# EAGLE design DIY_OpenEVSE_PLUS_v2w (EAGLE 7.1.0)
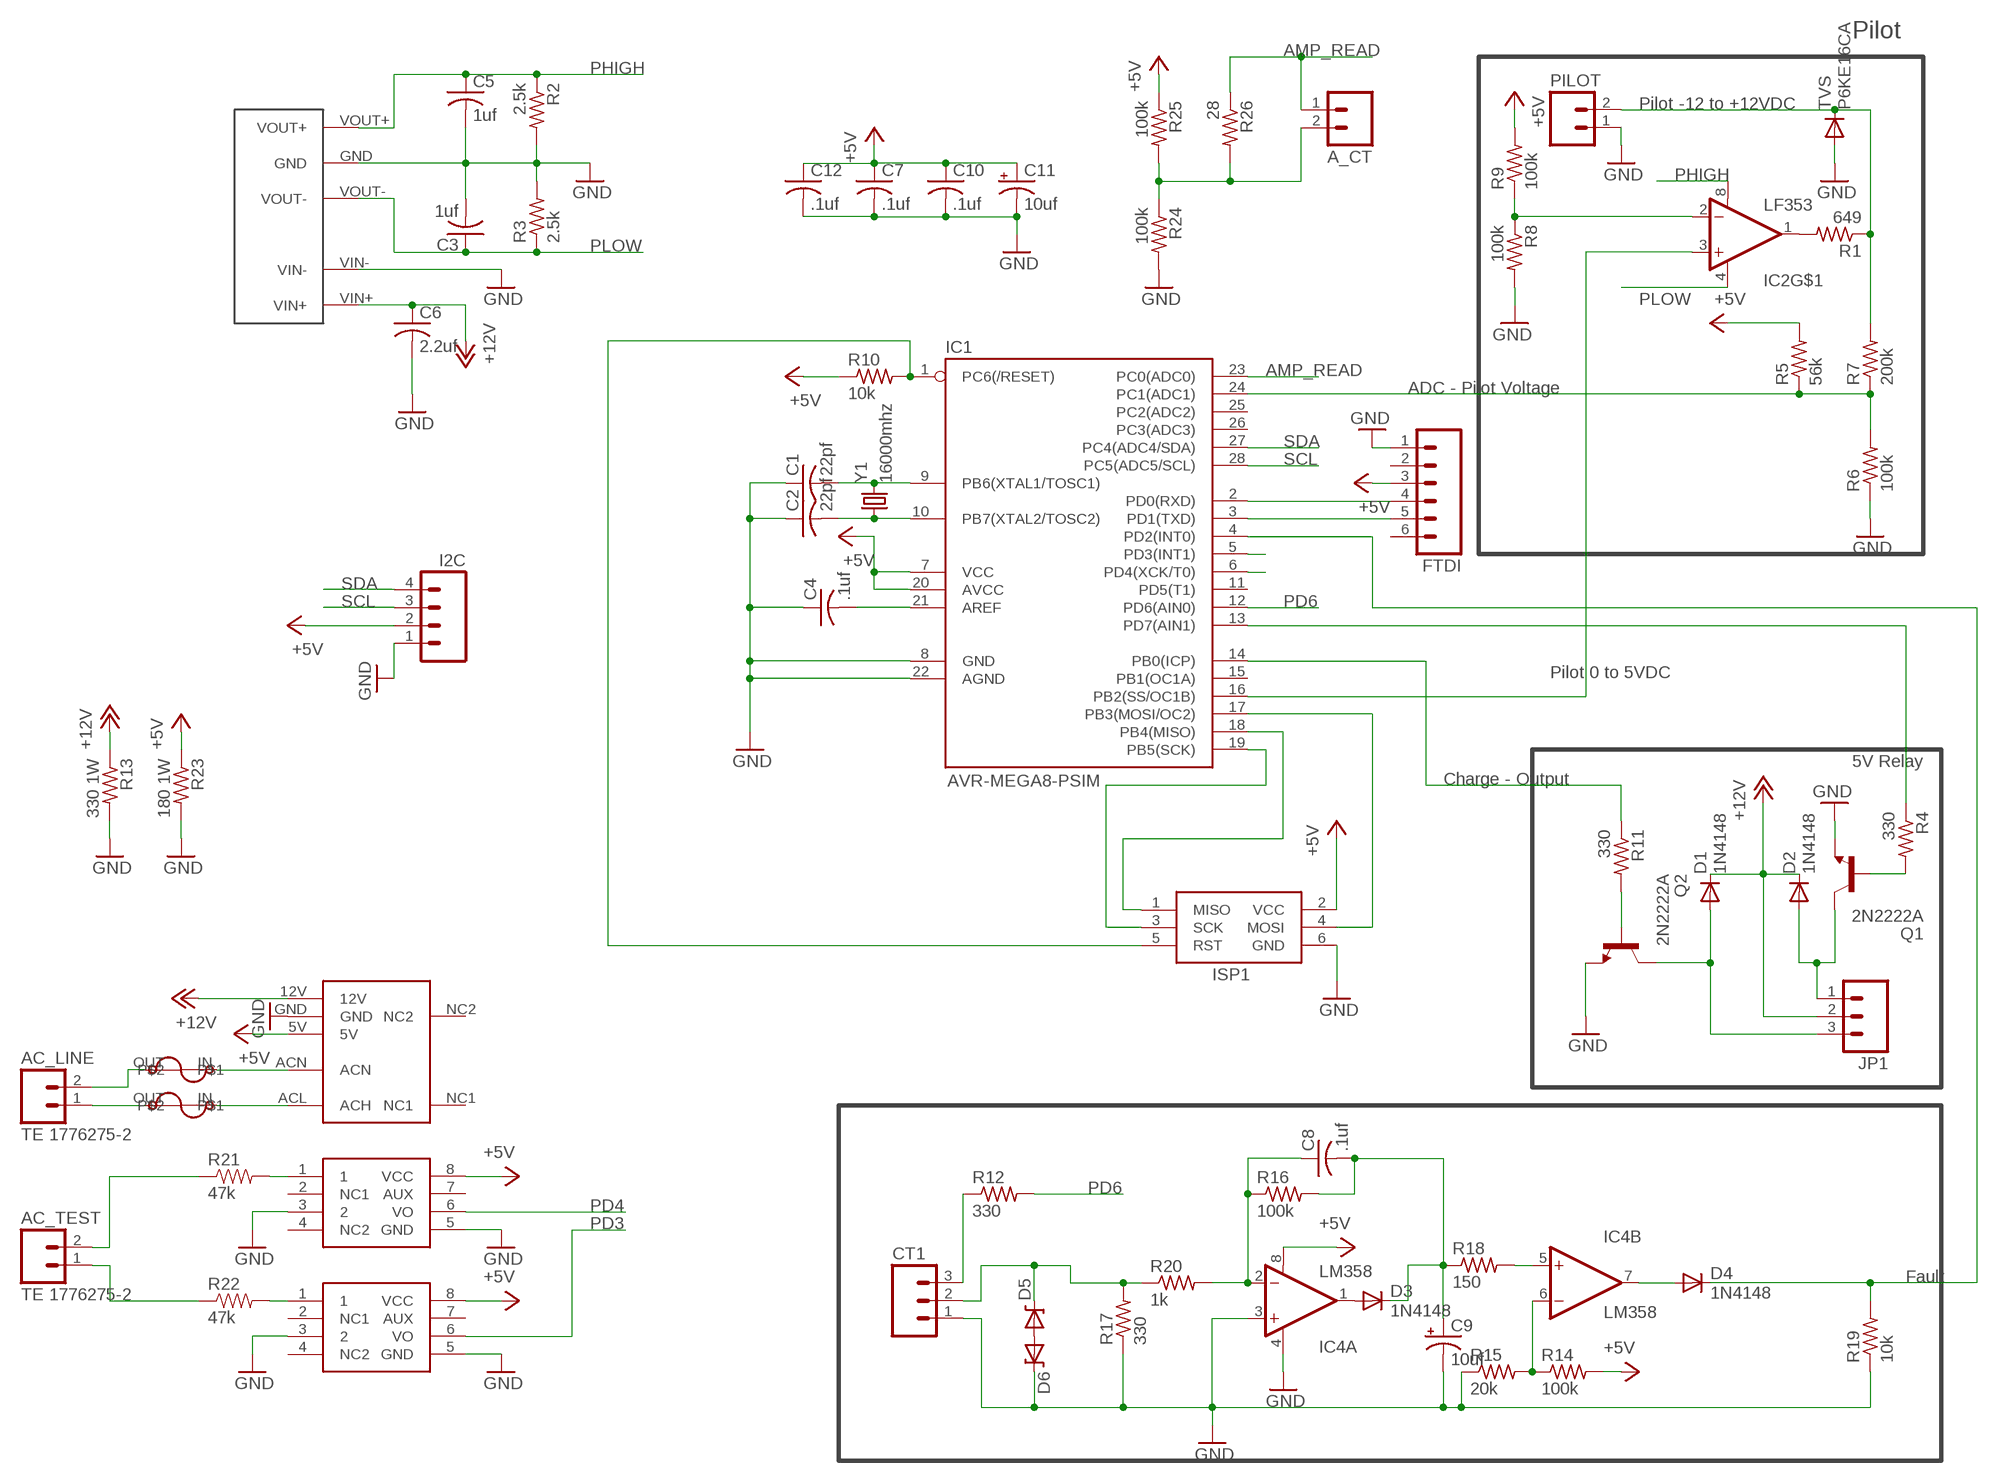
[diagram p0: schematic, sheet 1]

## Parts
A_CT  M02PTH  [1X02]
AC_LINE  TE 1776275-2  M023.5MM_LOCK  [SCREWTERMINAL-3.5MM-2_LOCK]
AC_TEST  TE 1776275-2  M023.5MM_LOCK  [SCREWTERMINAL-3.5MM-2_LOCK]
C1  22pf  C-US025-024X044  [C025-024X044]
C2  22pf  C-US025-024X044  [C025-024X044]
C3  1uf  C-US025-024X044  [C025-024X044]
C4  .1uf  C-US025-024X044  [C025-024X044]
C5  1uf  C-US025-024X044  [C025-024X044]
C6  2.2uf  C-US025-024X044  [C025-024X044]
C7  .1uf  C-US025-024X044  [C025-024X044]
C8  .1uf  C-US025-024X044  [C025-024X044]
C9  10uf  CAP_POLPTH2  [CPOL-RADIAL-10UF-25V]
C10  .1uf  C-US025-024X044  [C025-024X044]
C11  10uf  CAP_POLPTH2  [CPOL-RADIAL-10UF-25V]
C12  .1uf  C-US025-024X044  [C025-024X044]
CT1  M03LOCK  [1X03_LOCK]
D1  1N4148  DIODE1N4148  [DIODE-1N4148]
D2  1N4148  DIODE1N4148  [DIODE-1N4148]
D3  1N4148  DIODE1N4148  [DIODE-1N4148]
D4  1N4148  DIODE1N4148  [DIODE-1N4148]
D5  DIODE-ZENERPTH  [DIODE-ZENER]
D6  DIODE-ZENERPTH  [DIODE-ZENER]
DCDC  D107E  DCDC_SIP  [DCDC_SIP]
FTDI  M06LOCK  [1X06_LOCK]
I2C  M04LOCK  [1X04_LOCK]
IC1  AVR-MEGA8-PSIM  [DIL28-3-SIMON]
IC2  LF353  LM358  [DIP08]
IC3  MID400  [DIP08]
IC4  LM358  OPAMP-DUALDIP  [DIP08]
IC5  MID400  [DIP08]
ISP1  AVRISP-6  [AVRISP]
JP1  M03SCREW_LOCK  [SCREWTERMINAL-3.5MM-3_LOCK.007S]
PILOT  M025MM  [SCREWTERMINAL-5MM-2]
Q1  2N2222A  [TO18]
Q2  2N2222A  [TO18]
R1  649  R-US_0309/V  [0309V]
R2  2.5k  R-US_0309/V  [0309V]
R3  2.5k  R-US_0309/V  [0309V]
R4  330  R-US_0309/V  [0309V]
R5  56k  R-US_0309/V  [0309V]
R6  100k  R-US_0309/V  [0309V]
R7  200k  R-US_0309/V  [0309V]
R8  100k  R-US_0309/V  [0309V]
R9  100k  R-US_0309/V  [0309V]
R10  10k  R-US_0309/V  [0309V]
R11  330  R-US_0309/V  [0309V]
R12  330  R-US_0309/V  [0309V]
R13  330 1W  R-US_0309/V  [0309V]
R14  100k  R-US_0309/V  [0309V]
R15  20k  R-US_0309/V  [0309V]
R16  100k  R-US_0309/V  [0309V]
R17  330  R-US_0309/V  [0309V]
R18  150  R-US_0309/V  [0309V]
R19  10k  R-US_0309/V  [0309V]
R20  1k  R-US_0309/V  [0309V]
R21  47k  RESISTORPTH-1/4W  [AXIAL-0.4]
R22  47k  RESISTORPTH-1/4W  [AXIAL-0.4]
R23  180 1W  R-US_0309/V  [0309V]
R24  100k  R-US_0309/V  [0309V]
R25  100k  R-US_0309/V  [0309V]
R26  28  R-US_0309/V  [0309V]
TVS  P6KE16CA  DIODEPTH  [DIODE-1N4001]
U$3  BEL1AFUSE  [BELFUSE1A]
U$4  MPM-04E-1205  [MPM-04E-1205]
U$5  BEL1AFUSE  [BELFUSE1A]
Y1  16000mhz  CRYSTALHC49UV  [HC49U-V]

## Nets
+5V: C7.1 C10.1 C11.1(+) C12.1 FTDI.3 I2C.2 IC1.7(VCC) IC1.20(AVCC) IC3.8(VCC) IC4.8(A:V+) IC5.8(VCC) ISP1.2(VCC) R5.2 R9.2 R10.1 R14.2 R23.1 R25.1 U$4.5V
+12V: C6.1 D1.C D2.C DCDC.VIN+ JP1.2 R13.1 U$4.12V
AMP_READ: A_CT.1 IC1.23(PC0(ADC0)) R26.1
GND: C1.1 C2.1 C3.2 C4.1 C5.2 C6.2 C7.2 C9.2(-) C10.2 C11.2(-) C12.2 CT1.1 D6.P$1(C) DCDC.GND DCDC.VIN- FTDI.1 I2C.1 IC1.8(GND) IC1.22(AGND) IC3.3 IC3.5(GND) IC4.3(A:+IN) IC4.4(A:V-) IC5.3 IC5.5(GND) ISP1.6(GND) PILOT.1 Q1.1(E) Q2.1(E) R2.2 R3.2 R6.1 R8.2 R13.2 R15.1 R17.1 R19.1 R23.2 R24.2 TVS.A U$4.GND
N$1: AC_LINE.1 U$3.OUT
N$2: Q2.2(B) R11.2
N$3: PILOT.2 R1.1 R7.2 TVS.C
N$4: C1.2 IC1.9(PB6(XTAL1/TOSC1)) Y1.2
N$5: C2.2 IC1.10(PB7(XTAL2/TOSC2)) Y1.1
N$6: AC_LINE.2 U$5.OUT
N$7: C4.2 IC1.21(AREF)
N$8: FTDI.5 IC1.3(PD1(TXD))
N$9: IC3.1 R21.P$2
N$10: IC2.2(-IN) R8.1 R9.1
N$11: IC2.1(OUT) R1.2
N$12: FTDI.4 IC1.2(PD0(RXD))
N$13: D1.A JP1.3 Q2.3(C)
N$14: IC1.17(PB3(MOSI/OC2)) ISP1.4(MOSI)
N$15: IC1.19(PB5(SCK)) ISP1.3(SCK)
N$16: IC1.18(PB4(MISO)) ISP1.1(MISO)
N$17: IC5.1 R22.P$2
N$18: C8.1 IC4.2(A:-IN) R16.1 R20.2
N$19: IC4.5(B:+IN) R18.2
N$20: CT1.2 D5.P$1(C) R17.2 R20.1
N$21: D3.A IC4.1(A:OUT)
N$22: D5.P$2(A) D6.P$2(A)
N$23: C8.2 C9.1(+) D3.C R16.2 R18.1
N$24: IC4.6(B:-IN) R14.1 R15.2
N$25: D4.A IC4.7(B:OUT)
N$26: AC_TEST.2 R21.P$1
N$27: U$3.IN U$4.ACL(ACH)
N$28: D4.C IC1.4(PD2(INT0)) R19.2
N$29: AC_TEST.1 R22.P$1
N$30: U$4.ACN U$5.IN
N$31: Q1.2(B) R4.2
N$32: D2.A JP1.1 Q1.3(C)
N$33: IC1.13(PD7(AIN1)) R4.1
N$34: IC1.14(PB0(ICP)) R11.1
N$35: CT1.3 R12.1
N$36: A_CT.2 R24.1 R25.2 R26.2
N$53: IC1.24(PC1(ADC1)) R5.1 R6.2 R7.1
PD3: IC1.5(PD3(INT1)) IC5.6(VO)
PD4: IC1.6(PD4(XCK/T0)) IC3.6(VO)
PD6: IC1.12(PD6(AIN0)) R12.2
PHIGH: C5.1 DCDC.VOUT+ IC2.8(V+) R2.1
PLOW: C3.1 DCDC.VOUT- IC2.4(V-) R3.1
RST: IC1.1(PC6(/RESET)) ISP1.5(RST) R10.2
S$2: IC1.16(PB2(SS/OC1B)) IC2.3(+IN)
SCL: I2C.3 IC1.28(PC5(ADC5/SCL))
SDA: I2C.4 IC1.27(PC4(ADC4/SDA))
Unconnected: FTDI.2 FTDI.6 IC1.11(PD5(T1)) IC1.15(PB1(OC1A)) IC1.25(PC2(ADC2)) IC1.26(PC3(ADC3)) IC2.5(+IN) IC2.6(-IN) IC2.7(OUT) IC3.2(NC1) IC3.4(NC2) IC3.7(AUX) IC5.2(NC1) IC5.4(NC2) IC5.7(AUX) U$4.NC1 U$4.NC2

## Notes on the sheet
- Pilot
- Pilot -12 to +12VDC
- ADC - Pilot Voltage
- Pilot 0 to 5VDC
- 5V Relay
- Charge - Output
- Fault

## Library data of the parts
A_CT AC_LINE AC_TEST PILOT = SparkFun:M02: Header 2 Standard 2-pin 0.1" header. Use with straight break away headers (SKU : PRT-00116), right angle break away headers (PRT-00553), swiss pins (PRT-00743), machine pins (PRT-00117), and female headers (PRT-00115). Molex polarized connector foot print use with SKU : PRT-08233 with associated crimp pins and housings.
C1-C8 C10 C12 = adafruit:C-US: CAPACITOR, American symbol
C9 C11 = SparkFun:CAP_POL: Capacitor Polarized These are standard SMD and PTH capacitors. Normally 10uF, 47uF, and 100uF in electrolytic and tantalum varieties. Always verify the external diameter of the through hole cap, it varies with capacity, voltage, and manufacturer. The EIA devices should be standard.
CT1 JP1 = SparkFun:M03: Header 3 Standard 3-pin 0.1" header. Use with straight break away headers (SKU : PRT-00116), right angle break away headers (PRT-00553), swiss pins (PRT-00743), machine pins (PRT-00117), and female headers (PRT-00115). Molex polarized connector foot print use with SKU : PRT-08232 with associated crimp pins and housings.
D1-D4 TVS = SparkFun:DIODE: Diode These are standard reverse protection diodes and small signal diodes. SMA package can handle up to about 1A. SOD-323 can handle about 200mA. What the SOD-323 package when ordering, there are some mfgs out there that are 5-pin packages.
D5 D6 = SparkFun:DIODE-ZENER: Zener Diode Production Part - 8199 3.4V Zener Voltage
DCDC = Qxd:DCDC_SIP
FTDI = SparkFun:M06: Header 6 Standard 6-pin 0.1" header. Use with straight break away headers (SKU : PRT-00116), right angle break away headers (PRT-00553), swiss pins (PRT-00743), machine pins (PRT-00117), and female headers (PRT-00115). Molex polarized connector foot print use with SKU : PRT-08094 with associated crimp pins and housings. NOTES ON THE VARIANTS LOCK and LOCK_LONGPADS... This footprint was designed to help hold the alignment of a through-hole component (i.e. 6-pin header) while soldering it into place. You may notice that each hole has been shifted either up or down by 0.005 of an inch from it's more standard position (which is a perfectly straight line). This slight alteration caused the pins (the squares in the middle) to touch the edges of the holes. Because they are alternating, it causes a "brace" to hold the component in place. 0.005 has proven to be the perfect amount of "off-center" position when using our standard breakaway headers. Although looks a little odd when you look at the bare footprint, once you have a header in there, the alteration is very hard to notice. Also, if you push a header all the way into place, it is covered up entirely on the bottom side. This idea of altering the position of holes to aid alignment will be further integrated into the Sparkfun Library for other footprints. It can help hold any component with 3 or more connection pins.
I2C = SparkFun:M04: Header 4 Standard 4-pin 0.1" header. Use with straight break away headers (SKU : PRT-00116), right angle break away headers (PRT-00553), swiss pins (PRT-00743), machine pins (PRT-00117), and female headers (PRT-00115). Molex polarized connector foot print use with SKU : PRT-08231 with associated crimp pins and housings.
IC1 = SparkFun:AVR-MEGA8-P: MICROCONTROLLER 8 Kbytes FLASH 1 kbytes SRAM 512 bytes EEPROM USART 4-channel 10 bit ADC 2-channel 8 bit ADC
IC2 = SparkFun:LM358
IC3 IC5 = SparkFun:MID400
IC4 = SparkFun:OPAMP-DUAL: Operational Amplifier
ISP1 = adafruit:AVRISP: AVR ISP HEADER Standard 6 pin header for AVR programming
Q1 Q2 = transistor-npn:2N2222*: NPN Transistor
R1-R20 R23 = adafruit:R-US_: RESISTOR, American symbol
R21 R22 = SparkFun:RESISTOR: Resistor Basic schematic elements and footprints for 0603, 1206, and PTH resistors.
R24-R26 = rcl:R-US_: RESISTOR, American symbol
U$3 U$5 = Qxd:BEL1AFUSE
U$4 = Qxd:MPM-04E-1205
Y1 = SparkFun:CRYSTAL: Crystals Various standard crystals. Proven footprints. Spark Fun Electronics SKU : COM-00534

## Board
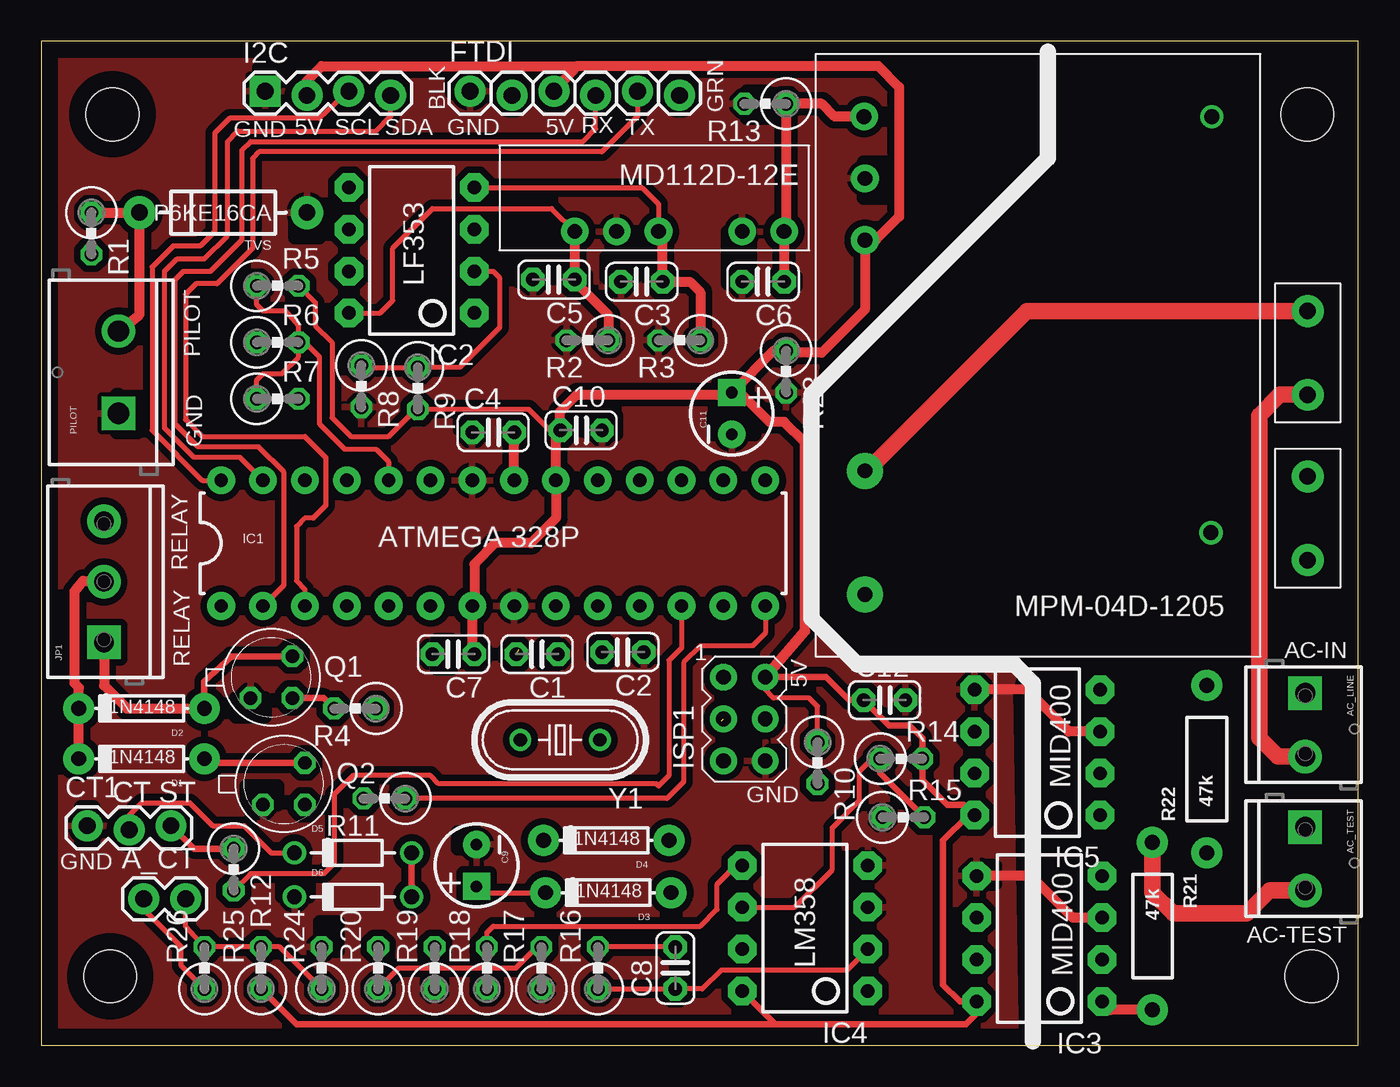
[diagram p1: board, top side]
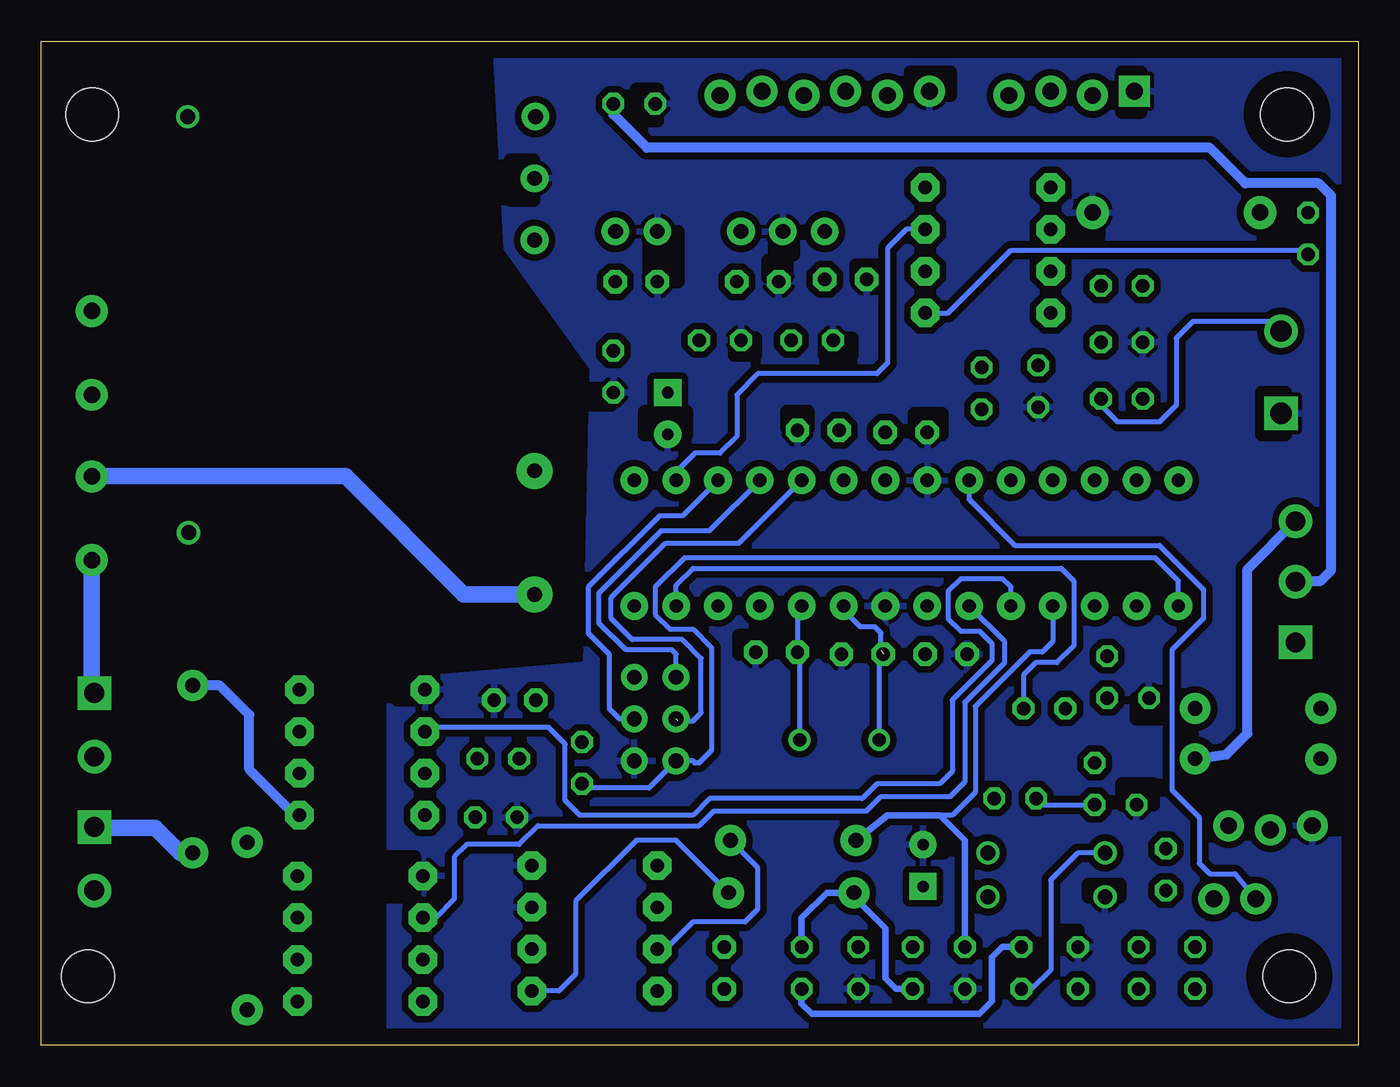
[diagram p2: board, bottom side, seen from below]

Size 79.93 x 60.95 mm. Coordinates in mm from the lower left corner, seen from the top.
Outline: 0,0 79.93,0 79.93,60.95 0,60.95 0,0
Copper layers (1*16): Top 0.035mm / dielectric 1.5mm / Bottom 0.035mm
Design rules "default": minimum track width 10mil, minimum drill 24mil, track to track 8mil, track to pad 8mil, pad to pad 8mil, via to via 8mil, smd to smd 8mil, copper to edge 40mil, drill to drill 8mil, minimum pad ring 10mil, minimum via ring 8mil, stop-mask expansion 4mil, vias tented up to drill 0mil, thermal gap 10mil
Holes 3.2 mm at 4.32,56.52 4.19,4.19 77.09,4.19 76.83,56.52
tRestrict: area 2.4,12.2 to 3.2,14.5; area 16.9,5.7 to 18,7.5; area 12.4,14.6 to 14.4,15.7; area 11.8,19.9 to 13.6,21.1; area 14.6,9 to 16.3,9.5; area 25.3,11.9 to 26.4,13; area 49,7.9 to 50.2,11.4; area 57.5,9.8 to 57.9,10.9; area 49.9,51.4 to 51.4,53.6; area 24.9,57.8 to 26.4,58.8; area 34.7,48 to 35.4,49.4; area 29,46.4 to 30.6,47.5; 17 more areas
bRestrict: area 13.2,56.6 to 14.4,59.1; area 24.8,57.7 to 27.2,59.1; area 42.5,56.1 to 43.8,58; area 15.7,49.3 to 16.4,50.5; area 29.3,46.5 to 30.5,47.4; area 34.7,46.6 to 35.8,47.6; area 34.3,48 to 35.4,49.3; area 41.5,46.5 to 42.9,49.3; area 30.7,41.9 to 32.4,42.9; area 36.6,41.9 to 37.8,42.9; area 45.3,38.9 to 46.4,39.9; area 4.4,37.1 to 5.8,39.6; 16 more areas

### Footprints (pad centres in the part's own frame; a part is rotated, then mirrored left to right if it is on the bottom)
1X02 = drill 1.016 pad 1.88: 1 0,0; 2 2.54,0
SCREWTERMINAL-3.5MM-2_LOCK = drill 1.2 pad 2.032 square: 1 -0.178,0 | drill 1.2 pad 2.032: 2 3.678,0
C025-024X044 = drill 0.813 pad 1.422 octagon: 1 -1.27,0; 2 1.27,0
CPOL-RADIAL-10UF-25V = drill 0.7 pad 1.651 square: 1 1.27,0 | drill 0.7 pad 1.651: 2 -1.27,0
1X03_LOCK = drill 1.016 pad 1.88: 1 0,0.127; 2 2.54,-0.127; 3 5.08,0.127
DIODE-1N4148 = drill 0.9 pad 1.88: A -3.81,0; C 3.81,0
DIODE-ZENER = drill 0.9: P$1 -3.556,0; P$2 3.556,0
DCDC_SIP = drill 0.9 pad 1.676: GND 10.16,0; VIN+ 0,0; VIN- 2.54,0; VOUT+ 12.7,0; VOUT- 7.62,0
1X06_LOCK = drill 1.016 pad 1.88: 1 0,0; 2 2.54,-0.254; 3 5.08,0; 4 7.62,-0.254; 5 10.16,0; 6 12.7,-0.254
1X04_LOCK = drill 1.016 pad 1.88 square: 1 0,0.127 | drill 1.016 pad 1.88: 2 2.54,-0.127; 3 5.08,0.127; 4 7.62,-0.127
DIL28-3-SIMON = drill 0.813 pad 1.676: 1 -16.51,-3.81; 2 -13.97,-3.81; 3 -11.43,-3.81; 4 -8.89,-3.81; 5 -6.35,-3.81; 6 -3.81,-3.81; 7 -1.27,-3.81; 8 1.27,-3.81; 9 3.81,-3.81; 10 6.35,-3.81; 11 8.89,-3.81; 12 11.43,-3.81; 13 13.97,-3.81; 14 16.51,-3.81; 15 16.51,3.81; 16 13.97,3.81; 17 11.43,3.81; 18 8.89,3.81; 19 6.35,3.81; 20 3.81,3.81; 21 1.27,3.81; 22 -1.27,3.81; 23 -3.81,3.81; 24 -6.35,3.81; 25 -8.89,3.81; 26 -11.43,3.81; 27 -13.97,3.81; 28 -16.51,3.81
DIP08 = drill 0.813 pad 1.727 octagon: 1 -3.81,-3.81; 2 -1.27,-3.81; 3 1.27,-3.81; 4 3.81,-3.81; 5 3.81,3.81; 6 1.27,3.81; 7 -1.27,3.81; 8 -3.81,3.81
AVRISP = drill 0.9 pad 1.626: 1 -1.27,2.54; 2 1.27,2.54; 3 -1.27,0; 4 1.27,0; 5 -1.27,-2.54; 6 1.27,-2.54
SCREWTERMINAL-3.5MM-3_LOCK.007S = drill 1.2 pad 2.032 square: 1 -0.178,0 | drill 1.2 pad 2.032: 2 3.5,0; 3 7.178,0
SCREWTERMINAL-5MM-2 = drill 1.3 pad 2.032 square: 1 0,0 | drill 1.3 pad 2.032: 2 5,0
TO18 = drill 0.813 octagon: 1 -1.27,-1.27; 2 1.27,-1.27; 3 1.27,1.27
0309V = drill 0.813 octagon: 1 -1.27,0; 2 1.27,0
AXIAL-0.4 = drill 0.9 pad 1.88: P$1 -5.08,0; P$2 5.08,0
DIODE-1N4001 = drill 1 pad 1.981: A -5.08,0; C 5.08,0
BELFUSE1A = drill 1 pad 1.93: IN 2,1.66; OUT 2,6.74
MPM-04E-1205 = drill 0.9 pad 1.676: 5V 3,25.25; 12V 2.95,32.75; GND 3,29 | drill 0.9 pad 2.184: ACL 3,3.75; ACN 3,11.25 | drill 0.9 pad 1.422: NC1 24,7.5 | drill 0.9: NC2 24.05,32.75
HC49U-V = drill 0.813: 1 -2.413,0; 2 2.413,0

### Placement (x,y rotation side)
A_CT  6.22,8.89 0 top
AC_LINE  76.71,21.21 270 top
AC_TEST  76.71,13.08 270 top
C1  30.1,23.75 180 top
C2  35.31,23.88 180 top
C3  36.45,46.35 180 top
C4  27.43,37.21 0 top
C5  31.11,46.48 180 top
C6  43.82,46.35 180 top
C7  25.02,23.75 180 top
C8  38.48,4.7 90 top
C9  26.42,10.92 270 top
C10  32.77,37.34 0 top
C11  41.91,38.35 90 top
C12  51.18,20.95 0 top
CT1  2.79,13.21 0 top
D1  6.1,17.4 180 top
D2  6.1,20.45 180 top
D3  34.42,9.27 180 top
D4  34.29,12.45 180 top
D5  18.92,11.68 0 top
D6  18.92,9.02 0 top
DCDC  45.09,49.4 180 top
FTDI  26.04,57.91 0 top
I2C  13.59,57.78 0 top
IC1  27.43,30.48 0 top
IC2  22.48,48.26 90 top
IC3  60.58,6.48 90 top
IC4  46.36,7.11 90 top
IC5  60.45,17.78 90 top
ISP1  42.67,19.81 0 top
JP1  3.81,24.64 90 top
PILOT  4.7,38.35 90 top
Q1  13.97,22.35 0 top
Q2  14.73,15.88 0 top
R1  3.05,49.28 270 top
R2  33.15,42.8 180 top
R3  38.73,42.8 180 top
R4  19.05,20.45 180 top
R5  14.35,46.1 0 top
R6  14.35,42.67 0 top
R7  14.35,39.24 0 top
R8  19.43,40.01 270 top
R9  22.86,39.88 270 top
R10  47.12,17.14 270 top
R11  20.83,14.99 180 top
R12  11.68,10.67 270 top
R13  43.94,57.15 180 top
R14  52.2,17.4 0 top
R15  52.32,13.84 0 top
R16  33.78,4.7 90 top
R17  30.35,4.7 90 top
R18  27.05,4.7 90 top
R19  23.88,4.7 90 top
R20  20.45,4.7 90 top
R21  67.44,7.24 270 top
R22  70.74,16.76 90 top
R23  45.21,40.89 270 top
R24  17.02,4.7 90 top
R25  13.34,4.7 90 top
R26  9.91,4.7 90 top
TVS  11.05,50.55 180 top
U$3  78.87,36.2 180 top
U$4  46.99,23.62 0 top
U$5  78.87,46.23 180 top
Y1  31.5,18.54 180 top

### Tracks (layer width: path | path; a pad name or v marks a point on that pad's centre or on a via)
+5V
  Top 0.305: R10.1 47.12,20.57 46.61,21.08 44.45,21.08 43.94,21.59 ISP1.2 | R5.2 16.64,45.09 16.64,43.69 17.65,42.67 17.65,38.1 18.8,36.96 21.08,36.96 22.61,38.48 R9.2 29.59,38.61 30.86,37.34 C10.1
  Top 0.406: ISP1.2 47.62,22.35 49.02,20.95 C12.1 51.44,19.43 52.71,19.43 53.47,18.67 R14.2 53.47,16.13 54.99,14.61 56.01,14.61 IC5.8 56.26,13.97 54.74,12.45 54.74,3.68 55.75,2.67 IC3.8 56.77,1.91 56.13,1.27 44.45,1.27 | R25.1 15.49,1.27 44.45,1.27 | IC4.8 44.45,1.4 44.45,1.27
  Top 0.61: C11.1 44.45,42.16 R23.1 45.34,42.04 47.37,42.04 49.99,44.66 U$4.5V 50.01,48.9 50.67,48.9 52.07,50.29 52.07,58.17 50.8,59.44 32.51,59.44 | C11.1 41.78,39.5 32.51,39.5 31.5,38.48 C10.1 31.24,37.08 IC1.20 31.24,32 29.72,30.48 27.56,30.48 26.29,29.21 26.29,26.8 IC1.7 26.16,24.26 C7.1 | ISP1.2 46.36,25.15 46.36,36.58 45.09,37.85 44.2,37.85 42.42,39.62 C11.1 | 32.51,59.44 FTDI.3 | I2C.2 16.13,58.55 17.02,59.44 32.51,59.44
  Bottom 0.61: 42.16,39.88 C11.1
+12V
  Top 0.61: U$4.12V 48.15,56.37 47.37,57.15 R13.1 45.21,49.53 DCDC.VIN+ C6.1 | D1.C D2.C 2.29,21.72 2.03,21.97 2.03,27.56 2.54,28.19 3.75,28.19 JP1.2
  Bottom 0.61: JP1.2 3.75,28.19 2.29,28.19 1.65,28.83 1.65,51.56 2.41,52.32 6.86,52.32 9.02,54.48 43.18,54.48 45.21,56.52 R13.1
AMP_READ
  Top 0.305: R26.1 8.51,4.83 8.51,5.97 5.97,8.51 A_CT.1
  Bottom 0.305: IC1.23 23.62,33.15 20.83,30.35 12.07,30.35 9.4,27.69 9.4,25.91 11.3,24 11.3,15.49 9.65,13.84 9.65,11.05 9.02,10.41 7.49,10.41 A_CT.1
GND
  Top 0.61: IC5.3 62.36,19.05 59.82,21.59 IC5.5 | IC3.3 62.61,7.75 60.07,10.29 IC3.5
  pour Bottom (isolate 0.406): -2.92,-7.11 53.98,-5.71 58.8,-5.71 58.8,22.1 46.86,23.11 46.48,41.15 51.69,48.39 52.32,60.33 45.85,62.36 -1.65,63.37
  pour Top (isolate 0.406): -1.52,-2.41 59.18,-2.16 58.8,21.59 59.05,22.61 56.01,22.86 54.48,22.61 49.28,23.11 46.99,24.89 46.99,41.02 52.32,48.9 52.58,61.85 49.4,62.48 -1.52,63.5
N$1
  Bottom 1.016: U$3.OUT 76.87,21.55 AC_LINE.1
N$2
  Bottom 0.305: R11.2 19.18,14.61 Q2.2
N$3
  Top 0.61: PILOT.2 5.97,44.37 TVS.C R1.1
  Bottom 0.305: R7.2 15.62,38.86 14.61,37.85 12.07,37.85 11.05,38.86 11.05,42.93 10.03,43.94 4.78,43.94 4.7,43.86 PILOT.2
N$4  (1 unrouted)
  Bottom 0.305: Y1.2 29.08,23.88 28.96,24 28.96,25.02 29.34,25.4 30.23,25.4 31.24,26.42 IC1.9
N$5
  Bottom 0.305: IC1.10 34.04,26.42 C2.2 33.91,24 Y1.1
N$6
  Top 1.016: AC_LINE.2 75.05,17.53 73.91,18.67 73.91,38.23 75.18,39.5 U$5.OUT
N$7
  Top 0.61: IC1.21 C4.2
N$8
  Top 0.305: FTDI.5 36.2,56.39 34.04,54.23 13.21,54.23 12.83,53.85 12.83,48.39 10.67,46.23 9.4,46.23 8.76,45.59 8.76,37.97 9.78,36.96 16,36.96 17.27,35.69 17.27,32.77 16.51,32 16,32 15.49,31.5 15.49,28.19 16,27.69 IC1.3
N$9
  Top 0.61: R21.P$2 64.9,2.16 IC3.1
N$10
  Top 0.305: R8.1 19.05,41.15 R9.1 25.4,41.15 27.81,43.56 27.81,46.61 27.43,46.99 IC2.2
N$11
  Bottom 0.305: IC2.1 24.89,44.45 21.08,48.26 3.56,48.26 3.3,48.51 R1.2
N$12
  Top 0.305: IC1.2 14.73,27.94 14.73,34.8 13.21,36.32 9.53,36.32 8.13,37.72 8.13,46.48 8.64,46.99 10.29,46.99 12.19,48.9 12.19,54.36 12.7,54.86 32.89,54.86 33.66,55.63 FTDI.4
N$13
  Top 0.406: D1.A 9.91,17.14 Q2.3
  Bottom 0.61: D1.A 8,17.65 6.73,18.92 6.73,28.89 JP1.3
N$14
  Bottom 0.305: IC1.17 41.02,32.13 42.42,32.13 46.74,27.81 46.74,25.02 45.47,23.75 45.47,20.45 44.83,19.81 ISP1.4
N$15  (1 unrouted)
  Bottom 0.305: 41.28,19.68 40.39,19.68 39.88,20.19 39.88,23.5 41.02,24.64 44.07,24.64 45.34,25.91 45.34,27.18 42.04,30.48 37.59,30.48 IC1.19
N$16
  Bottom 0.305: ISP1.1 41.4,23.75 41.66,24 44.45,24 46.1,25.65 46.1,27.43 42.29,31.24 39.37,31.24 IC1.18
N$17
  Bottom 0.61: IC5.1 64.52,13.97 67.31,16.76 67.31,20.07 69.09,21.84 R22.P$2
N$18
  Top 0.305: IC4.2 48.9,4.57 41.28,4.57 40.13,3.43 C8.1 R16.1
  Bottom 0.406: R20.2 21.59,5.97 22.22,5.33 22.22,2.67 22.99,1.91 33.15,1.91 33.78,2.54 R16.1
N$19
  Top 0.305: R18.2 27.05,6.86 27.43,7.24 40.01,7.24 41.02,8.26 41.02,9.78 42.16,10.92 IC4.5
N$20
  Top 0.305: R20.1 21.72,4.7 28.83,4.7 30.1,5.97 R17.2 | D5.P$1 13.97,11.68 12.32,13.34 10.41,13.34 9.02,14.73 6.1,14.73 5.33,13.97 CT1.2
  Bottom 0.305: D5.P$1 17.02,11.68 18.67,10.03 18.67,4.57 19.81,3.43 R20.1
N$21
  Bottom 0.305: D3.A 41.4,12.45 43.82,12.45 47.5,8.76 47.5,4.32 48.51,3.3 IC4.1
N$22
  Top 0.406: D6.P$2 D5.P$2
N$23
  Top 0.305: C8.2 R16.2 | C9.1 26.8,9.27 D3.C
  Bottom 0.406: R16.2 33.78,7.75 32.26,9.27 D3.C 30.1,9.02 30.1,8.51 28.7,7.11 28.7,4.06 28.07,3.43 R18.1
N$24
  Top 0.305: 52.96,13.84 R15.2 | IC4.6 45.72,8.38 48.01,10.67 48.01,13.21 49.66,14.86 49.66,16.64 50.42,17.4 R14.1
  Top 0.406: R15.2 50.93,16.51 R14.1
N$25
  Bottom 0.305: D4.A 36.45,10.79 36.45,8.26 37.21,7.49 40.39,7.49 42.04,5.84 IC4.7
N$26
  Top 1.016: AC_TEST.2 74.55,9.4 73.15,8 68.71,8 67.44,9.27 R21.P$1
N$27
  Bottom 1.016: U$4.ACL 54.3,27.37 61.47,34.54 U$3.IN
N$28
  Bottom 0.305: IC1.4 18.54,24.51 19.18,23.88 19.94,23.88 23.24,20.57 23.24,15.37 24.64,13.97 25.4,13.97
  Bottom 0.406: R19.2 23.88,12.45 25.4,13.97 28.57,13.97 D4.C
N$29
  Bottom 1.016: R22.P$1 71.5,11.68 73.02,13.21 76.66,13.21 AC_TEST.1
N$30
  Top 1.016: U$4.ACN 50.11,34.87 59.82,44.58 U$5.IN
N$31
  Top 0.406: R4.2 17.14,21.08 Q1.2
N$32
  Top 0.406: Q1.3 11.56,23.62 9.91,22.1 D2.A
  Top 0.61: JP1.1 3.81,21.84 5.21,20.45 D2.A
N$33
  Bottom 0.305: R4.1 20.32,22.48 19.56,23.24 18.29,23.24 17.27,24.26 17.27,28.19 18.03,28.96 40.39,28.96 41.4,27.94 IC1.13
N$34
  Top 0.305: IC1.14 43.94,25.02 43.18,24.26 40.01,24.26 38.99,23.24 38.99,16 37.97,14.99 R11.1
N$35
  Top 0.406: CT1.3 9.27,11.94 R12.1
N$36
  Top 0.305: R24.1 14.48,5.97 R25.2 R26.2 8.76,7.24 A_CT.2
N$53
  Top 0.305: 21.08,34.67 IC1.24 21.08,35.43 20.32,36.2 18.41,36.2 16.89,37.72 16.89,41.78 16,42.67 R6.2 | 12.95,39.12 R7.1 13.08,40.39 13.46,40.77 14.61,40.77 15.62,41.78 R6.2 | R6.2 15.62,43.69 14.86,44.58 13.46,44.58 13.08,44.96 R5.1
PD3
  Bottom 0.305: IC1.5 21.08,27.81 21.59,28.32 24.13,28.32 24.89,27.56 24.89,25.91 24.13,25.15 22.99,25.15 22.22,24.38 22.22,23.37 24.64,20.95 24.64,16.64 25.4,15.88 29.21,15.88 30.1,14.99 39.37,14.99 40.39,13.97 47.24,13.97 48.13,14.86 48.13,18.29 49.15,19.3 56.39,19.3 IC5.6
PD4
  Bottom 0.305: IC1.6 21.46,24.51 21.46,23.24 23.88,20.83 23.88,16 24.77,15.11 28.96,15.11 29.84,14.22 39.12,14.22 40.01,13.34 49.78,13.34 50.93,12.19 54.1,12.19 54.86,11.43 54.86,8.89 56.01,7.75 IC3.6
PD6
  Top 0.305: IC1.12 38.86,24.13 38.1,23.37 38.1,16.38 37.47,15.75 37.34,15.88 24.13,15.88 23.62,16.38 18.92,16.38 17.78,15.24 17.78,11.05 17.14,10.41 12.7,10.41 R12.2
PHIGH
  Top 0.305: IC2.8 20.57,44.45 21.34,45.21 21.34,48.39 23.75,50.8 30.99,50.8 DCDC.VOUT+
  Top 0.61: DCDC.VOUT+ C5.1 32.39,46.35 34.42,44.32 R2.1
PLOW
  Top 0.305: IC2.4 36.45,52.07 37.47,51.05 DCDC.VOUT-
  Top 0.61: DCDC.VOUT- 37.72,49.15 C3.1 39.37,46.35 40.01,45.72 R3.1
RST
  Bottom 0.305: IC1.1 10.92,28.19 12.32,29.59 40.89,29.59 42.67,27.81 42.67,26.16 41.78,25.27 40.39,25.27 39.24,24.13 39.24,17.91 40.01,17.14 40.26,17.14 40.39,17.27 ISP1.5 43.05,15.62 46.61,15.62 46.86,15.88 R10.2
S$2
  Bottom 0.305: IC2.3 27.43,49.53 28.57,48.39 28.57,41.4 29.21,40.77 36.45,40.77 37.72,39.5 37.72,36.96 38.73,35.94 40.26,35.94 41.4,34.8 IC1.16
SCL
  Top 0.305: I2C.3 16.89,56.26 11.43,56.26 10.54,55.37 10.54,49.4 9.65,48.51 8,48.51 6.73,47.24 6.73,37.34 9.78,34.29 IC1.28
SDA
  Top 0.305: IC1.27 12.07,35.69 9.27,35.69 7.49,37.47 7.49,46.99 8.26,47.75 9.91,47.75 11.3,49.15 11.3,54.86 11.94,55.5 20.32,55.5 21.21,56.39 I2C.4

### Text on the board
tNames: BLK | GRN | GND | 5V | SCL | SDA | GND | 5V | RX | TX | MD112D-12E | LF353 | PILOT | + | GND | ATMEGA 328P | RELAY | MPM-04D-1205 | RELAY | AC-IN | 5V | MID400 | CT | ST | GND | GND | + | AC-TEST | LM358 | MID400